# EAGLE schematic Dashboard r1 (EAGLE 7.1.0)
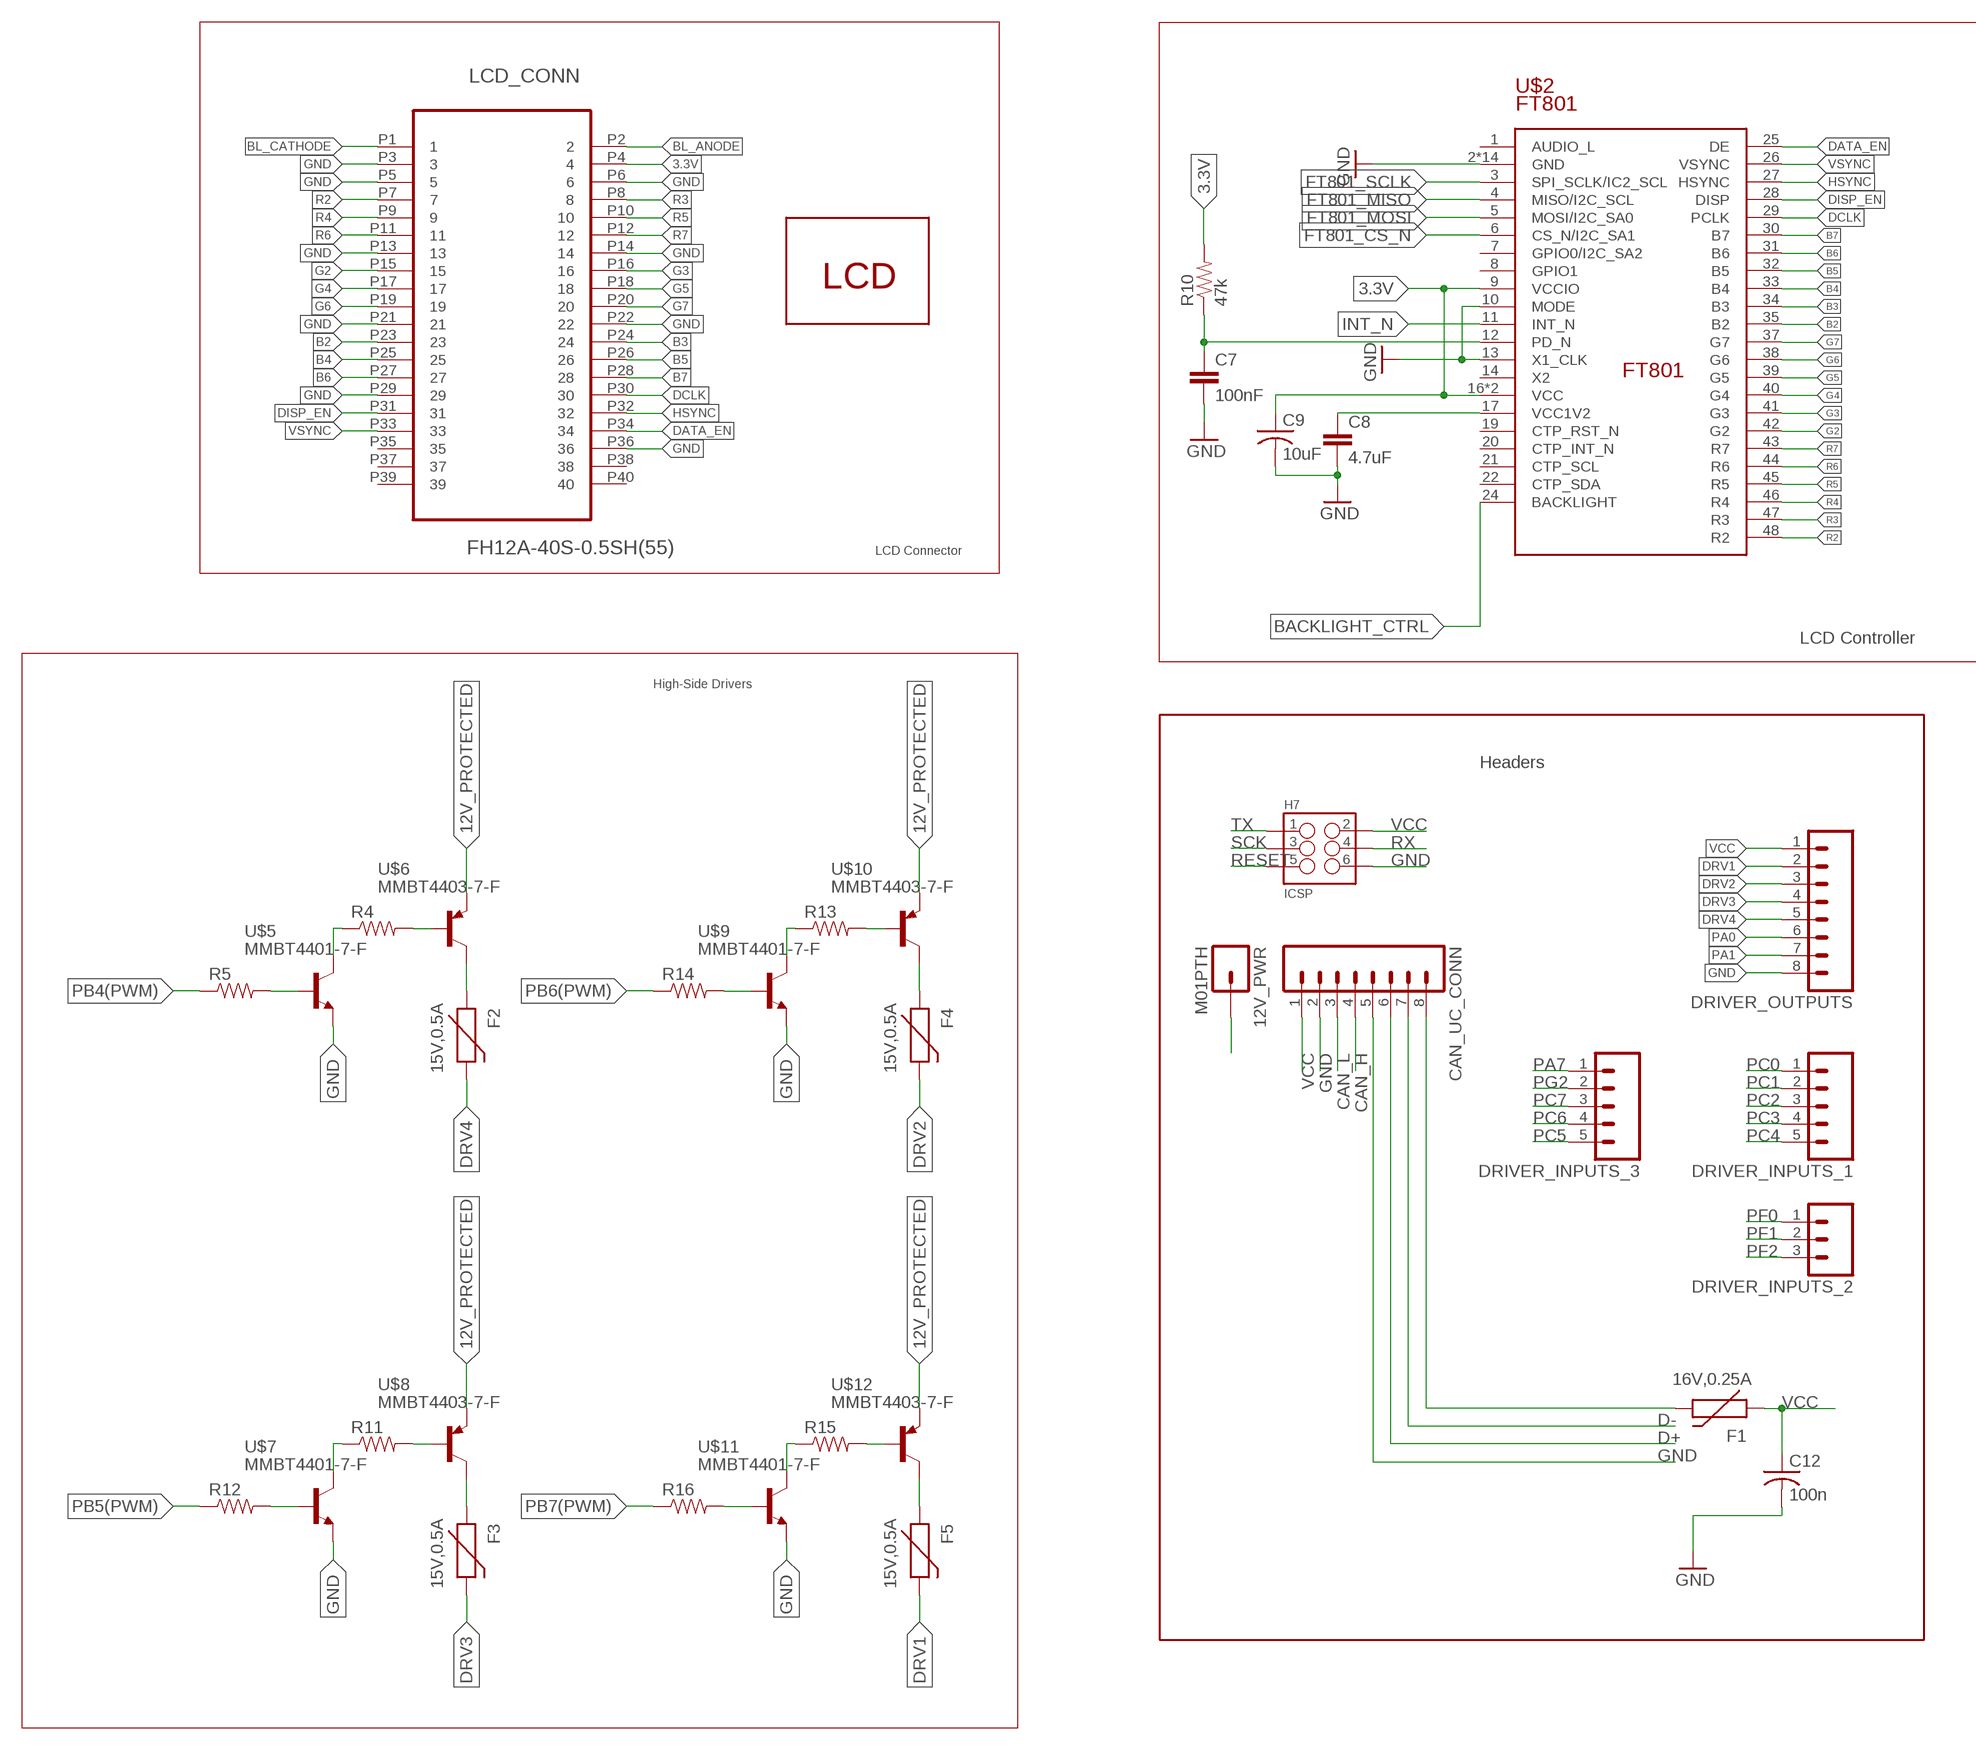
[diagram p0: schematic, sheet 1, part 1 of 2]
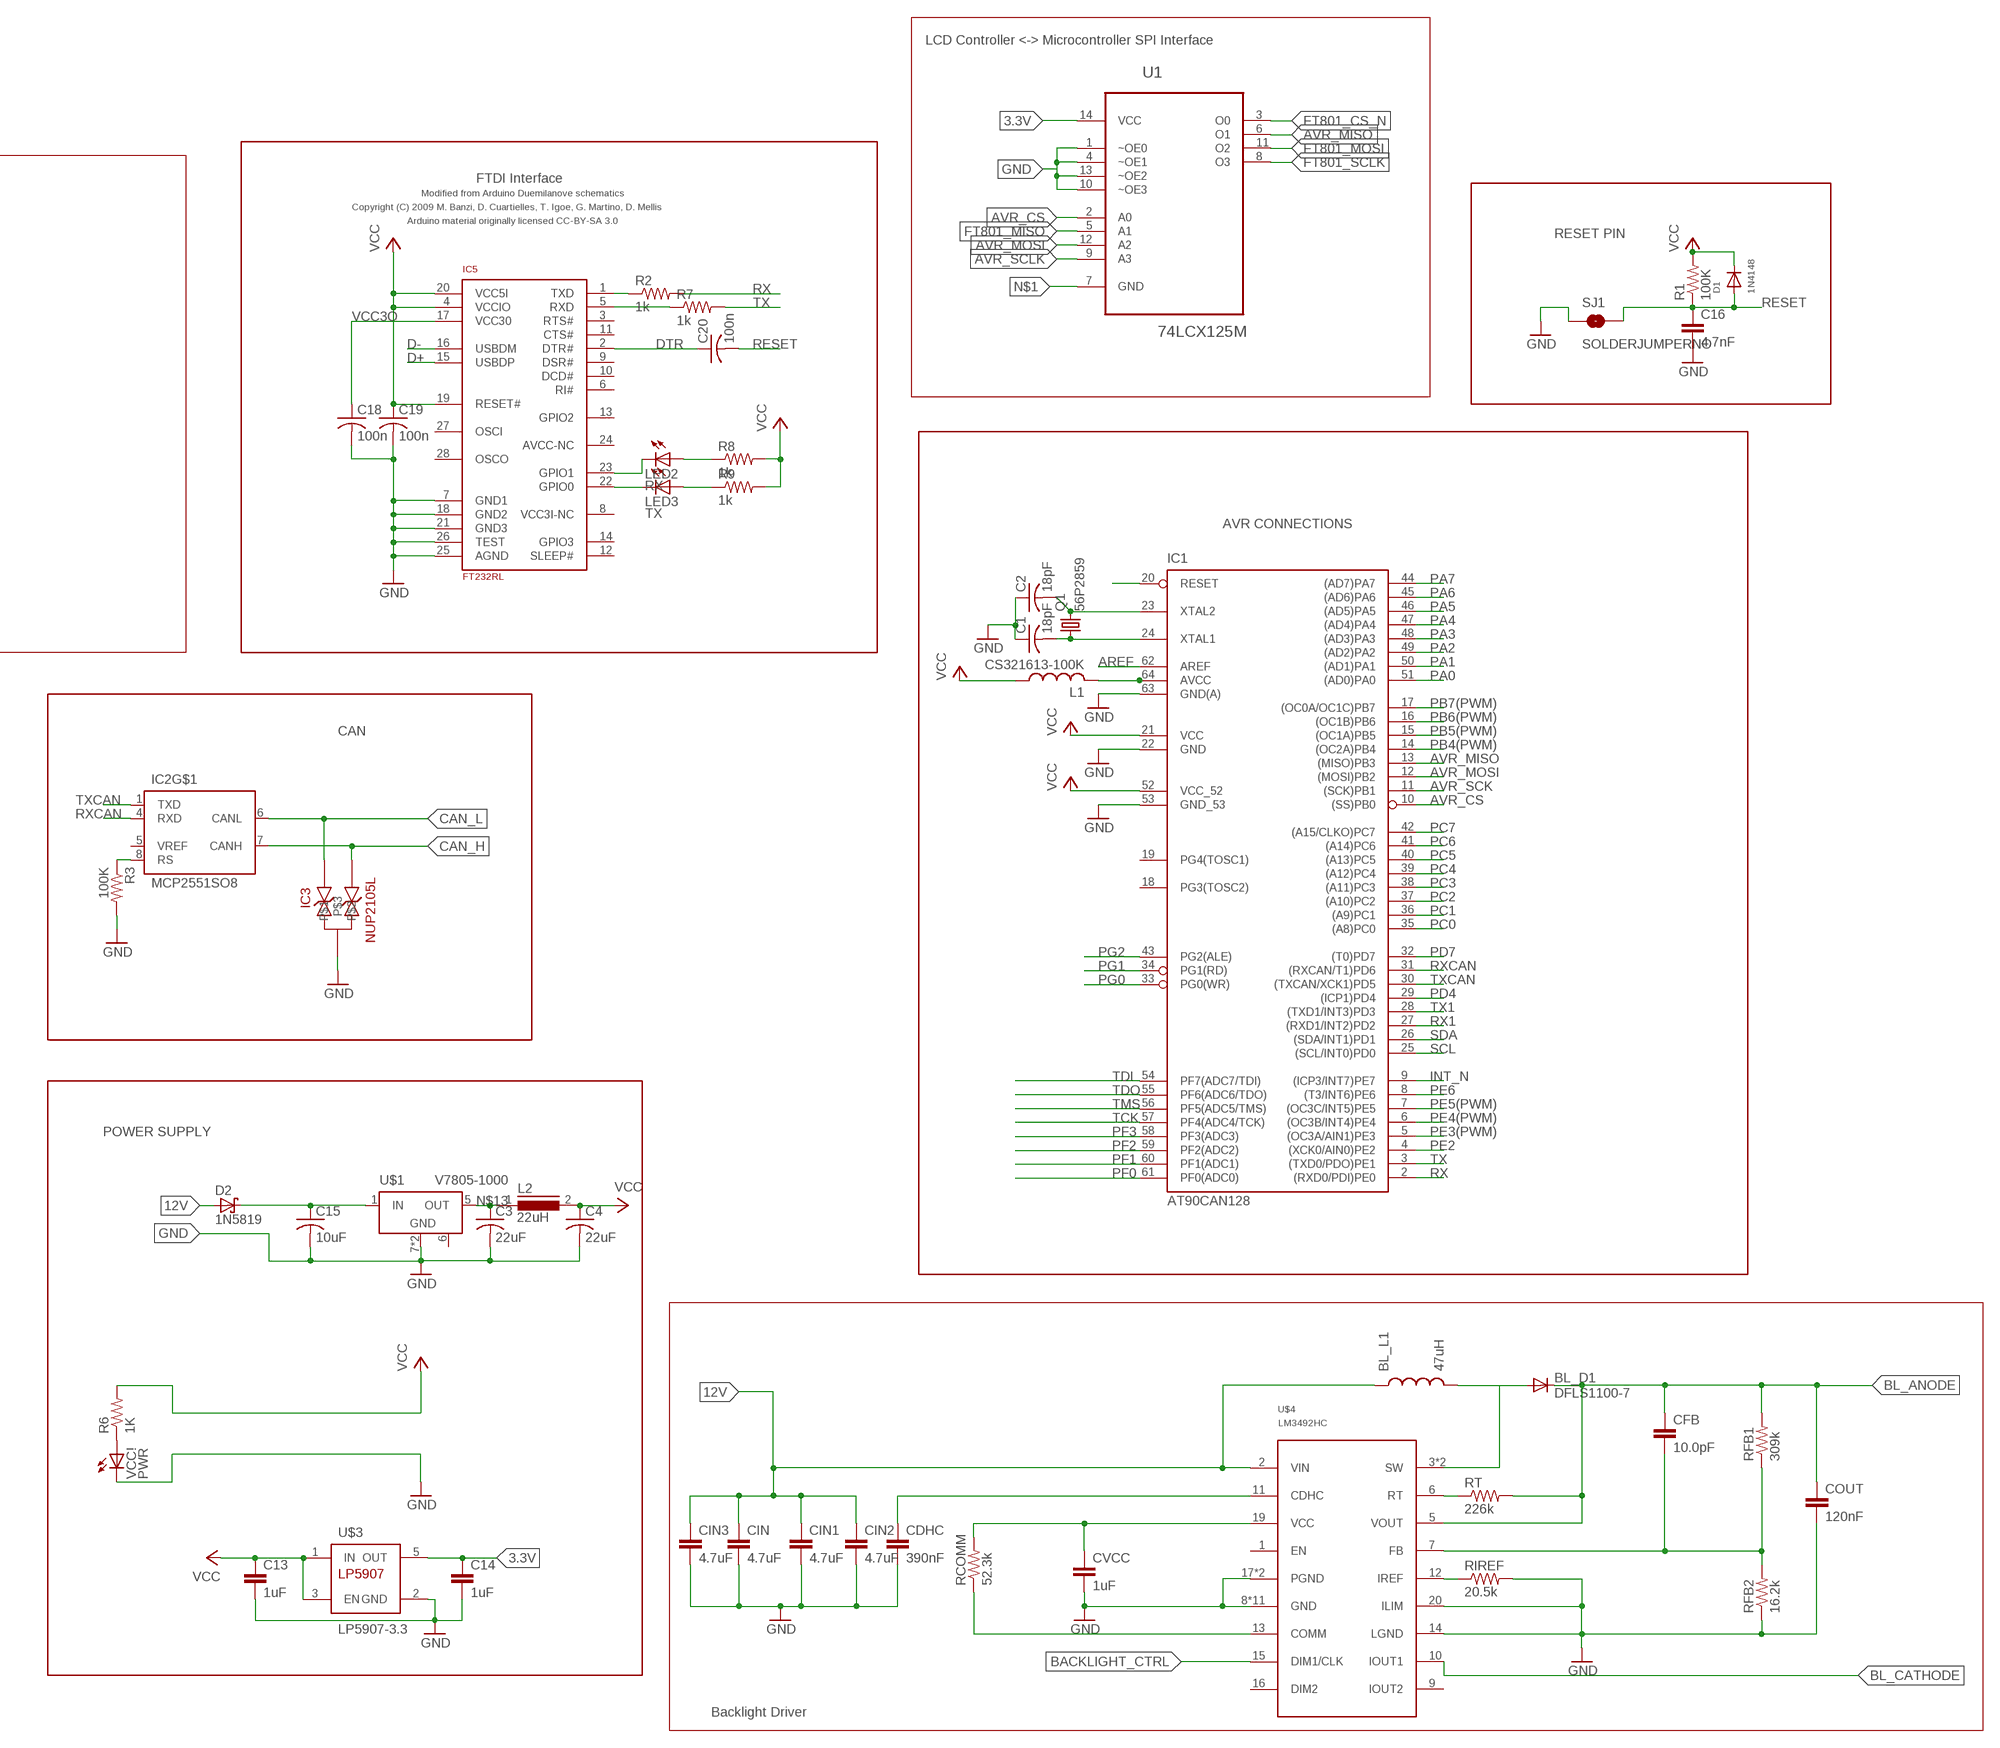
[diagram p1: schematic, sheet 1, part 2 of 2]

## Parts
12V_PWR  M01PTH  [1X01]
BL_D1  DFLS1100-7  [POWERDI-123]
BL_L1  47uH  LTF4022-D  [2-SMD]
C1  18pF  C-USC0805  [C0805]
C2  18pF  C-USC0805  [C0805]
C3  22uF  C-USC2220  [C2220]
C4  22uF  C-USC2220  [C2220]
C7  100nF  CAP0603-CAP  [0603-CAP]
C8  4.7uF  CAP0805  [0805]
C9  10uF  C-USC2220  [C2220]
C12  100n  C-USC0805  [C0805]
C13  1uF  CAP0603-CAP  [0603-CAP]
C14  1uF  CAP0603-CAP  [0603-CAP]
C15  10uF  C-USC2220  [C2220]
C16  4.7nF  CAP0805  [0805]
C18  100n  C-USC0805  [C0805]
C19  100n  C-USC0805  [C0805]
C20  100n  C-USC0805  [C0805]
CAN_UC_CONN  M081X08  [1X08]
CDHC  390nF  CAP0603-CAP  [0603-CAP]
CFB  10.0pF  CAP0603-CAP  [0603-CAP]
CIN  4.7uF  CAP0805  [0805]
CIN1  4.7uF  CAP0805  [0805]
CIN2  4.7uF  CAP0805  [0805]
CIN3  4.7uF  CAP0805  [0805]
COUT  120nF  CAP0805  [0805]
CVCC  1uF  CAP0603-CAP  [0603-CAP]
D1  1N4148  DIODESOD-123  [SOD-123]
D2  1N5819  1N5819-BSOD123  [SOD123]
DRIVER_INPUTS_1  M05PTH  [1X05]
DRIVER_INPUTS_2  M03PTH  [1X03]
DRIVER_INPUTS_3  M05PTH  [1X05]
DRIVER_OUTPUTS  M081X08  [1X08]
F1  16V,0.25A  PTCSMD  [PTC-1206]
F2  15V,0.5A  PTCSMD  [PTC-1206]
F3  15V,0.5A  PTCSMD  [PTC-1206]
F4  15V,0.5A  PTCSMD  [PTC-1206]
F5  15V,0.5A  PTCSMD  [PTC-1206]
H7  ICSP  M03X2SMD_FCI  [2X3_SMD_FCI_54202-G30]
IC1  AT90CAN128  [TQFP64]
IC2  MCP2551SO8  [SO08]
IC3  NUP2105L  [SOT-23]
IC5  FT232RL  [SSOP28]
L1  CS321613-100K  L-USL3216C  [L3216C]
L2  22uH  DR73  [DR73]
LCD_CONN  FH12A-40S-0.5SH(55)  [HIROSE_FH12A-40S-0.5SH(55)]
LED2  RX  LEDCHIPLED_0805  [CHIPLED_0805]
LED3  TX  LEDCHIPLED_0805  [CHIPLED_0805]
Q1  56P2859  CRYSTALSMD  [HC49UP]
R1  100K  R-US_R0805  [R0805]
R2  1k  R-US_R0805  [R0805]
R3  100K  R-US_R0805  [R0805]
R4  RESISTOR0603  [0603-RES]
R5  RESISTOR0603  [0603-RES]
R6  1K  R-US_R0805  [R0805]
R7  1k  R-US_R0805  [R0805]
R8  1k  R-US_R0805  [R0805]
R9  1k  R-US_R0805  [R0805]
R10  47k  RESISTOR0603  [0603-RES]
R11  RESISTOR0603  [0603-RES]
R12  RESISTOR0603  [0603-RES]
R13  RESISTOR0603  [0603-RES]
R14  RESISTOR0603  [0603-RES]
R15  RESISTOR0603  [0603-RES]
R16  RESISTOR0603  [0603-RES]
RCOMM  52.3k  RESISTOR0603  [0603-RES]
RFB1  309k  RESISTOR0603-RES  [0603-RES]
RFB2  16.2k  RESISTOR0603-RES  [0603-RES]
RIREF  20.5k  RESISTOR0603-RES  [0603-RES]
RT  226k  RESISTOR0603-RES  [0603-RES]
SJ1  SOLDERJUMPERNO  [SJ_2S-NO]
U1  74LCX125M  [SOIC127P600X175-14N]
U$1  V7805-1000  V78XX-1000  [V78XX-1000]
U$2  FT801  [RGZ48_5P15X5P15]
U$3  LP5907-3.3  LP5907  [SOT23-DBV]
U$4  LM3492HC  [PWP0020A]
U$5  MMBT4401-7-F  [SOT-23-3]
U$6  MMBT4403-7-F  [SOT-23-3]
U$7  MMBT4401-7-F  [SOT-23-3]
U$8  MMBT4403-7-F  [SOT-23-3]
U$9  MMBT4401-7-F  [SOT-23-3]
U$10  MMBT4403-7-F  [SOT-23-3]
U$11  MMBT4401-7-F  [SOT-23-3]
U$12  MMBT4403-7-F  [SOT-23-3]
U$13  TCG043WQLBAANN-GN00  [TCG043WQLBAANN]
VCC!  PWR  LEDCHIPLED_0805  [CHIPLED_0805]

## Nets
3.3V: C9.1 C14.1 LCD_CONN.P4 R10.2 U1.14(VCC) U$2.9(VCCIO) U$2.16(VCC) U$2.18(VCC) U$3.5(OUT)
12V: 12V_PWR.1 BL_L1.1 CIN1.1 CIN2.1 CIN3.1 CIN.1 D2.A U$4.2(VIN)
12V_PROTECTED: C15.1 D2.C U$1.1(IN) U$6.P$3(E) U$8.P$3(E) U$10.P$3(E) U$12.P$3(E)
AREF: IC1.62(AREF)
AVR_CS: IC1.10((SS)PB0) U1.2(A0)
AVR_MISO: IC1.13((MISO)PB3) U1.6(O1)
AVR_MOSI: IC1.12((MOSI)PB2) U1.12(A2)
AVR_SCK: IC1.11((SCK)PB1)
AVR_SCLK: U1.9(A3)
B2: LCD_CONN.P23 U$2.35(B2)
B3: LCD_CONN.P24 U$2.34(B3)
B4: LCD_CONN.P25 U$2.33(B4)
B5: LCD_CONN.P26 U$2.32(B5)
B6: LCD_CONN.P27 U$2.31(B6)
B7: LCD_CONN.P28 U$2.30(B7)
BACKLIGHT_CTRL: U$2.24(BACKLIGHT) U$4.15(DIM1/CLK)
BL_ANODE: BL_D1.C CFB.1 COUT.1 LCD_CONN.P2 RFB1.2 RT.2 U$4.5(VOUT)
BL_CATHODE: LCD_CONN.P1 U$4.10(IOUT1)
CAN_H: CAN_UC_CONN.4 IC2.7(CANH) IC3.2
CAN_L: CAN_UC_CONN.3 IC2.6(CANL) IC3.1
D+: CAN_UC_CONN.6 IC5.15(USBDP)
D-: CAN_UC_CONN.7 IC5.16(USBDM)
DATA_EN: LCD_CONN.P34 U$2.25(DE)
DCLK: LCD_CONN.P30 U$2.29(PCLK)
DISP_EN: LCD_CONN.P31 U$2.28(DISP)
DRV1: DRIVER_OUTPUTS.2 F5.2
DRV2: DRIVER_OUTPUTS.3 F4.2
DRV3: DRIVER_OUTPUTS.4 F3.2
DRV4: DRIVER_OUTPUTS.5 F2.2
DTR: C20.1 IC5.2(DTR#)
FT801_CS_N: U1.3(O0) U$2.6(CS_N/I2C_SA1)
FT801_MISO: U1.5(A1) U$2.4(MISO/I2C_SCL)
FT801_MOSI: U1.11(O2) U$2.5(MOSI/I2C_SA0)
FT801_SCLK: U1.8(O3) U$2.3(SPI_SCLK/IC2_SCL)
G2: LCD_CONN.P15 U$2.42(G2)
G3: LCD_CONN.P16 U$2.41(G3)
G4: LCD_CONN.P17 U$2.40(G4)
G5: LCD_CONN.P18 U$2.39(G5)
G6: LCD_CONN.P19 U$2.38(G6)
G7: LCD_CONN.P20 U$2.37(G7)
GND: C1.1 C2.1 C3.2 C4.2 C7.2 C8.2 C9.2 C12.2 C13.2 C14.2 C15.2 C16.2 C18.2 C19.2 CAN_UC_CONN.2 CAN_UC_CONN.5 CDHC.2 CIN1.2 CIN2.2 CIN3.2 CIN.2 COUT.2 CVCC.2 DRIVER_OUTPUTS.8 H7.6 IC1.22(GND) IC1.53(GND_53) IC1.63(GND(A)) IC3.3 IC5.7(GND1) IC5.18(GND2) IC5.21(GND3) IC5.25(AGND) IC5.26(TEST) LCD_CONN.P3 LCD_CONN.P5 LCD_CONN.P6 LCD_CONN.P13 LCD_CONN.P14 LCD_CONN.P21 LCD_CONN.P22 LCD_CONN.P29 LCD_CONN.P36 R3.2 RFB2.1 RIREF.2 SJ1.1 U1.1(~OE0) U1.4(~OE1) U1.10(~OE3) U1.13(~OE2) U$1.7(GND) U$1.9(GND) U$2.2(GND) U$2.10(MODE) U$2.13(X1_CLK) U$2.15(GND) U$2.23(GND) U$2.36(GND) U$2.EP(GND) U$2.V_1(GND) U$2.V_2(GND) U$2.V_3(GND) U$2.V_4(GND) U$2.V_5(GND) U$2.V_6(GND) U$2.V_7(GND) U$2.V_8(GND) U$2.V_9(GND) U$3.2(GND) U$4.8(GND) U$4.14(LGND) U$4.17(PGND) U$4.18(PGND) U$4.20(ILIM) U$4.EP(GND) U$4.P$1(GND) U$4.P$2(GND) U$4.P$3(GND) U$4.P$4(GND) U$4.P$5(GND) U$4.P$6(GND) U$4.P$7(GND) U$4.P$8(GND) U$4.P$9(GND) U$5.P$3(E) U$7.P$3(E) U$9.P$3(E) U$11.P$3(E) VCC!.C
HSYNC: LCD_CONN.P32 U$2.27(HSYNC)
INT_N: IC1.9((ICP3/INT7)PE7) U$2.11(INT_N)
M8RXD: IC5.1(TXD) R2.1
M8TXD: IC5.5(RXD) R7.1
N$1 [gnd]: U1.7(GND)
N$2: C8.1 U$2.17(VCC1V2)
N$3: C7.1 R10.1 U$2.12(PD_N)
N$4: CVCC.1 RCOMM.2 U$4.19(VCC)
N$5: RCOMM.1 U$4.13(COMM)
N$6: IC2.8(RS) R3.1
N$7: CDHC.1 U$4.11(CDHC)
N$8: BL_D1.A BL_L1.2 U$4.3(SW) U$4.4(SW)
N$9: R6.1 VCC!.A
N$10: CFB.2 RFB1.1 RFB2.2 U$4.7(FB)
N$11: C1.2 IC1.24(XTAL1) Q1.1
N$12: RT.1 U$4.6(RT)
N$13: C3.1 L2.1 U$1.5(OUT)
N$14: RIREF.1 U$4.12(IREF)
N$22: IC1.64(AVCC) L1.2
N$23: R5.2 U$5.P$2(B)
N$24: R4.2 U$6.P$2(B)
N$25: R4.1 U$5.P$1(C)
N$26: F2.1 U$6.P$1(C)
N$27: R12.2 U$7.P$2(B)
N$28: R11.2 U$8.P$2(B)
N$29: R11.1 U$7.P$1(C)
N$30: F3.1 U$8.P$1(C)
N$31: R14.2 U$9.P$2(B)
N$32: IC5.23(GPIO1) LED2.C
N$33: R13.2 U$10.P$2(B)
N$34: IC5.22(GPIO0) LED3.C
N$35: LED2.A R8.1
N$36: LED3.A R9.1
N$37: R13.1 U$9.P$1(C)
N$38: F4.1 U$10.P$1(C)
N$39: R16.2 U$11.P$2(B)
N$40: R15.2 U$12.P$2(B)
N$41: R15.1 U$11.P$1(C)
N$42: F5.1 U$12.P$1(C)
PA0: DRIVER_OUTPUTS.6 IC1.51((AD0)PA0)
PA1: DRIVER_OUTPUTS.7 IC1.50((AD1)PA1)
PA2: IC1.49((AD2)PA2)
PA3: IC1.48((AD3)PA3)
PA4: IC1.47((AD4)PA4)
PA5: IC1.46((AD5)PA5)
PA6: IC1.45((AD6)PA6)
PA7: DRIVER_INPUTS_3.1 IC1.44((AD7)PA7)
PB4(PWM): IC1.14((OC2A)PB4) R5.1
PB5(PWM): IC1.15((OC1A)PB5) R12.1
PB6(PWM): IC1.16((OC1B)PB6) R14.1
PB7(PWM): IC1.17((OC0A/OC1C)PB7) R16.1
PC0: DRIVER_INPUTS_1.1 IC1.35((A8)PC0)
PC1: DRIVER_INPUTS_1.2 IC1.36((A9)PC1)
PC2: DRIVER_INPUTS_1.3 IC1.37((A10)PC2)
PC3: DRIVER_INPUTS_1.4 IC1.38((A11)PC3)
PC4: DRIVER_INPUTS_1.5 IC1.39((A12)PC4)
PC5: DRIVER_INPUTS_3.5 IC1.40((A13)PC5)
PC6: DRIVER_INPUTS_3.4 IC1.41((A14)PC6)
PC7: DRIVER_INPUTS_3.3 IC1.42((A15/CLKO)PC7)
PD4: IC1.29((ICP1)PD4)
PD7: IC1.32((T0)PD7)
PE2: IC1.4((XCK0/AIN0)PE2)
PE3(PWM): IC1.5((OC3A/AIN1)PE3)
PE4(PWM): IC1.6((OC3B/INT4)PE4)
PE5(PWM): IC1.7((OC3C/INT5)PE5)
PE6: IC1.8((T3/INT6)PE6)
PF0: DRIVER_INPUTS_2.1 IC1.61(PF0(ADC0))
PF1: DRIVER_INPUTS_2.2 IC1.60(PF1(ADC1))
PF2: DRIVER_INPUTS_2.3 IC1.59(PF2(ADC2))
PF3: IC1.58(PF3(ADC3))
PG0: IC1.33(PG0(WR))
PG1: IC1.34(PG1(RD))
PG2: DRIVER_INPUTS_3.2 IC1.43(PG2(ALE))
R2: LCD_CONN.P7 U$2.48(R2)
R3: LCD_CONN.P8 U$2.47(R3)
R4: LCD_CONN.P9 U$2.46(R4)
R5: LCD_CONN.P10 U$2.45(R5)
R6: LCD_CONN.P11 U$2.44(R6)
R7: LCD_CONN.P12 U$2.43(R7)
RESET: C16.1 C20.2 D1.A H7.5 IC1.20(RESET) R1.1 SJ1.2
RX: H7.4 IC1.2((RXD0/PDI)PE0) R2.2
RX1: IC1.27((RXD1/INT2)PD2)
RXCAN: IC1.31((RXCAN/T1)PD6) IC2.4(RXD)
SCK: H7.3
SCL: IC1.25((SCL/INT0)PD0)
SDA: IC1.26((SDA/INT1)PD1)
TCK: IC1.57(PF4(ADC4/TCK))
TDI: IC1.54(PF7(ADC7/TDI))
TDO: IC1.55(PF6(ADC6/TDO))
TMS: IC1.56(PF5(ADC5/TMS))
TX: H7.1 IC1.3((TXD0/PDO)PE1) R7.2
TX1: IC1.28((TXD1/INT3)PD3)
TXCAN: IC1.30((TXCAN/XCK1)PD5) IC2.1(TXD)
USB_V_IN [usbvcc]: CAN_UC_CONN.8 F1.2
VCC: C4.1 C12.1 C13.1 C19.1 CAN_UC_CONN.1 D1.C DRIVER_OUTPUTS.1 F1.1 H7.2 IC1.21(VCC) IC1.52(VCC_52) IC5.4(VCCIO) IC5.19(RESET#) IC5.20(VCC5I) L1.1 L2.2 R1.2 R6.2 R8.2 R9.2 U$3.1(IN) U$3.3(EN)
VCC3O: C18.1 IC5.17(VCC30)
VSYNC: LCD_CONN.P33 U$2.26(VSYNC)
XTAL1: C2.2 IC1.23(XTAL2) Q1.2
Unconnected: IC1.18(PG3(TOSC2)) IC1.19(PG4(TOSC1)) IC2.5(VREF) IC5.3(RTS#) IC5.6(RI#) IC5.8(VCC3I-NC) IC5.9(DSR#) IC5.10(DCD#) IC5.11(CTS#) IC5.12(SLEEP#) IC5.13(GPIO2) IC5.14(GPIO3) IC5.24(AVCC-NC) IC5.27(OSCI) IC5.28(OSCO) LCD_CONN.P35 LCD_CONN.P37 LCD_CONN.P38 LCD_CONN.P39 LCD_CONN.P40 U$1.6 U$2.1(AUDIO_L) U$2.7(GPIO0/I2C_SA2) U$2.8(GPIO1) U$2.14(X2) U$2.19(CTP_RST_N) U$2.20(CTP_INT_N) U$2.21(CTP_SCL) U$2.22(CTP_SDA) U$4.1(EN) U$4.9(IOUT2) U$4.16(DIM2)

## Notes on the sheet
- LCD Controller <-> Microcontroller SPI Interface
- FTDI Interface
- Modified from Arduino Duemilanove schematics
- Copyright (C) 2009 M. Banzi, D. Cuartielles, T. Igoe, G. Martino, D. Mellis
- Arduino material originally licensed CC-BY-SA 3.0
- RESET PIN
- AVR CONNECTIONS
- LCD Connector
- LCD Controller
- High-Side Drivers
- Headers | CAN
- POWER SUPPLY
- Backlight Driver

## Power pins joined to a net without a drawn wire
GND: IC2.2(GND)
VCC: IC2.3(VCC)

## Library data of the parts
12V_PWR = SparkFun-Connectors:M01: Header 1 Standard 1-pin 0.1" header. Use with straight break away headers (SKU : PRT-00116), right angle break away headers (PRT-00553), swiss pins (PRT-00743), machine pins (PRT-00117), and female headers (PRT-00115).
BL_D1 = diodes-inc:DFLS1100-7
BL_L1 = tdk:LTF4022-D: LTF4022
C1 C2 C12 C18-C20 = rcl:C-US: CAPACITOR, American symbol
C3 C4 C9 C15 = resistor:C-US: CAPACITOR, American symbol
C7 C8 C13 C14 C16 CDHC CIN CIN1-CIN3 CVCC = SparkFun-Capacitors:CAP: Capacitor Standard 0603 ceramic capacitor, and 0.1" leaded capacitor.
CAN_UC_CONN DRIVER_OUTPUTS = SparkFun-Connectors:M08: Header 8 Standard 8-pin 0.1" header. Use with straight break away headers (SKU : PRT-00116), right angle break away headers (PRT-00553), swiss pins (PRT-00743), machine pins (PRT-00117), and female headers (PRT-00115).
CFB COUT = SparkFun-Passives:CAP: Capacitor Standard 0603 ceramic capacitor, and 0.1" leaded capacitor.
D1 = adafruit:DIODE: Diode SMADIODE - SMA Surface Mount Package 20V 1A Schottky Diode Digikey: 641-1014-6-ND DO-1N4148 - Through Hole Small Current Diode SOD-123 20V 1 A (.5mV Vf) Schottky Diode - Digikey: MBRX120TPMSCT-ND SOD-323 10V 570mA (.38mV Vf, 3ns) Schottky Diode - Digikey: ZLLS410CT-ND SOD-523 30V 30mA Schottky Diode (RB751S-40TE61) - Digikey: RB751S-40TE61CT-ND SOT23-R/W - SOT23 Package (R = Solder Paste/Reflow Ovens, W = Hand-Soldering) BAT54Film 40V 300mA - Digikey: 497-7162-1-ND
D2 = diode:1N581*: 1.0A SCHOTTKY BARRIER RECTIFIER Source: http://www.diodes.com/datasheets/ds23001.pdf
DRIVER_INPUTS_1 DRIVER_INPUTS_3 = SparkFun-Connectors:M05: Header 5 Standard 5-pin 0.1" header. Use with straight break away headers (SKU : PRT-00116), right angle break away headers (PRT-00553), swiss pins (PRT-00743), machine pins (PRT-00117), and female headers (PRT-00115). Molex polarized connector foot print use with SKU : PRT-08230 with associated crimp pins and housings.
DRIVER_INPUTS_2 = SparkFun-Connectors:M03: Header 3 Standard 3-pin 0.1" header. Use with straight break away headers (SKU : PRT-00116), right angle break away headers (PRT-00553), swiss pins (PRT-00743), machine pins (PRT-00117), and female headers (PRT-00115). Molex polarized connector foot print use with SKU : PRT-08232 with associated crimp pins and housings.
F1-F5 = SparkFun:PTC: Resettable Fuse PTC Resettable Fuse. Spark Fun Electronics SKU : COM-08357
H7 = SparkFun-Connectors:M03X2: 2x3 .1" header. Shrouded, with keying- CONN-10681 SMT- CONN-11415 Pogo pins- HW-11044
IC1 = at90can128:AT90CAN128
IC2 = can:MCP2551: CAN Tranceiver Microchip
IC3 = Artificial Science:NUP2105L
IC5 = SmartPrj:FT232RL
L1 = rcl:L-US: INDUCTOR, American symbol
L2 = inductors:DR73: High Power Density, High Efficiency, Shielded Inductors Source: coiltronics_dr_series.pdf
LCD_CONN = hirose:FH12A-40S-0.5SH(55): SOCKET FFC/FPC, ZIF, 0.5MM, 40WAY; MPN: FH12A-40S-0.5SH(55); OC_FARNELL: 1324569; OC_NEWARK: 34M6194; PACKAGE: SOCKET FFC/FPC, ZIF, 0.5MM, 40WAY; SUPPLIER: Hirose
LED2 LED3 VCC! = led:LED: LED OSRAM: - CHIPLED LG R971, LG N971, LY N971, LG Q971, LY Q971, LO R971, LY R971 LH N974, LH R974 LS Q976, LO Q976, LY Q976 LO Q996 - Hyper CHIPLED LW Q18S LB Q993, LB Q99A, LB R99A - SideLED LS A670, LO A670, LY A670, LG A670, LP A670 LB A673, LV A673, LT A673, LW A673 LH A674 LY A675 LS A676, LA A676, LO A676, LY A676, LW A676 LS A679, LY A679, LG A679 - Hyper Micro SIDELED® LS Y876, LA Y876, LO Y876, LY Y876 LT Y87S - SmartLED LW L88C, LW L88S LB L89C, LB L89S, LG L890 LS L89K, LO L89K, LY L89K LS L896, LA L896, LO L896, LY L896 - TOPLED LS T670, LO T670, LY T670, LG T670, LP T670 LSG T670, LSP T670, LSY T670, LOP T670, LYG T670 LG T671, LOG T671, LSG T671 LB T673, LV T673, LT T673, LW T673 LH T674 LS T676, LA T676, LO T676, LY T676, LB T676, LH T676, LSB T676, LW T676 LB T67C, LV T67C, LT T67C, LS T67K, LO T67K, LY T67K, LW E67C LS E67B, LA E67B, LO E67B, LY E67B, LB E67C, LV E67C, LT E67C LW T67C LS T679, LY T679, LG T679 LS T770, LO T770, LY T770, LG T770, LP T770 LB T773, LV T773, LT T773, LW T773 LH T774 LS E675, LA E675, LY E675, LS T675 LS T776, LA T776, LO T776, LY T776, LB T776 LHGB T686 LT T68C, LB T68C - Hyper Mini TOPLED® LB M676 - Mini TOPLED Santana® LG M470 LS M47K, LO M47K, LY M47K Source: http://www.osram.convergy.de LUXEON: - LUMILED® LXK2-PW12-R00, LXK2-PW12-S00, LXK2-PW14-U00, LXK2-PW14-V00 LXK2-PM12-R00, LXK2-PM12-S00, LXK2-PM14-U00 LXK2-PE12-Q00, LXK2-PE12-R00, LXK2-PE12-S00, LXK2-PE14-T00, LXK2-PE14-U00 LXK2-PB12-K00, LXK2-PB12-L00, LXK2-PB12-M00, LXK2-PB14-N00, LXK2-PB14-P00, LXK2-PB14-Q00 LXK2-PR12-L00, LXK2-PR12-M00, LXK2-PR14-Q00, LXK2-PR14-R00 LXK2-PD12-Q00, LXK2-PD12-R00, LXK2-PD12-S00 LXK2-PH12-R00, LXK2-PH12-S00 LXK2-PL12-P00, LXK2-PL12-Q00, LXK2-PL12-R00 Source: www.luxeon.com KINGBRIGHT: KA-3528ASYC Source: www.kingbright.com
Q1 = SparkFun-FreqCtrl:CRYSTAL: Various standard crystals. Proven footprints. Spark Fun Electronics SKU : COM-00534
R1-R3 R6-R9 = rcl:R-US_: RESISTOR, American symbol
R4 R5 R10-R16 RCOMM = SparkFun-Resistors:RESISTOR: Resistor Basic schematic elements and footprints for 0603, 1206, and PTH resistors.
RFB1 RFB2 RIREF RT = SparkFun-Passives:RESISTOR: Resistor Basic schematic elements and footprints for 0603, 1206, and PTH resistors.
SJ1 = SparkFun-Passives:SOLDERJUMPER: Solder Jumper Standard SMD solder jumper. Used to automate production. Two varients : Normally Open and Normally Closed are the same, but have different paste layers. NC will have a large amount of paste and should jumper during reflow.
U1 = Fairchild_By_element14_Batch_1:74LCX125M: Low Voltage Quad Buffer with 5V Tolerant Inputs and Outputs; MPN: 74LCX125M; OC_FARNELL: 1013776; OC_NEWARK: 78K6286; PACKAGE: SOIC-14; SUPPLIER: Fairchild
U$1 = formula electric:V78XX-1000
U$2 = ftdichip:FT801: IC TFT LCD CONTROLLER 48VQFN
U$3 = texas:LP5907
U$4 = texas:LM3492HC
U$5 U$7 U$9 U$11 = formula electric:MMBT4401-7-F
U$6 U$8 U$10 U$12 = formula electric:MMBT4403-7-F
U$13 = kyocera:TCG043WQLBAANN-GN00